# Altium project CHOCO_KEYBOARD.PrjPcb
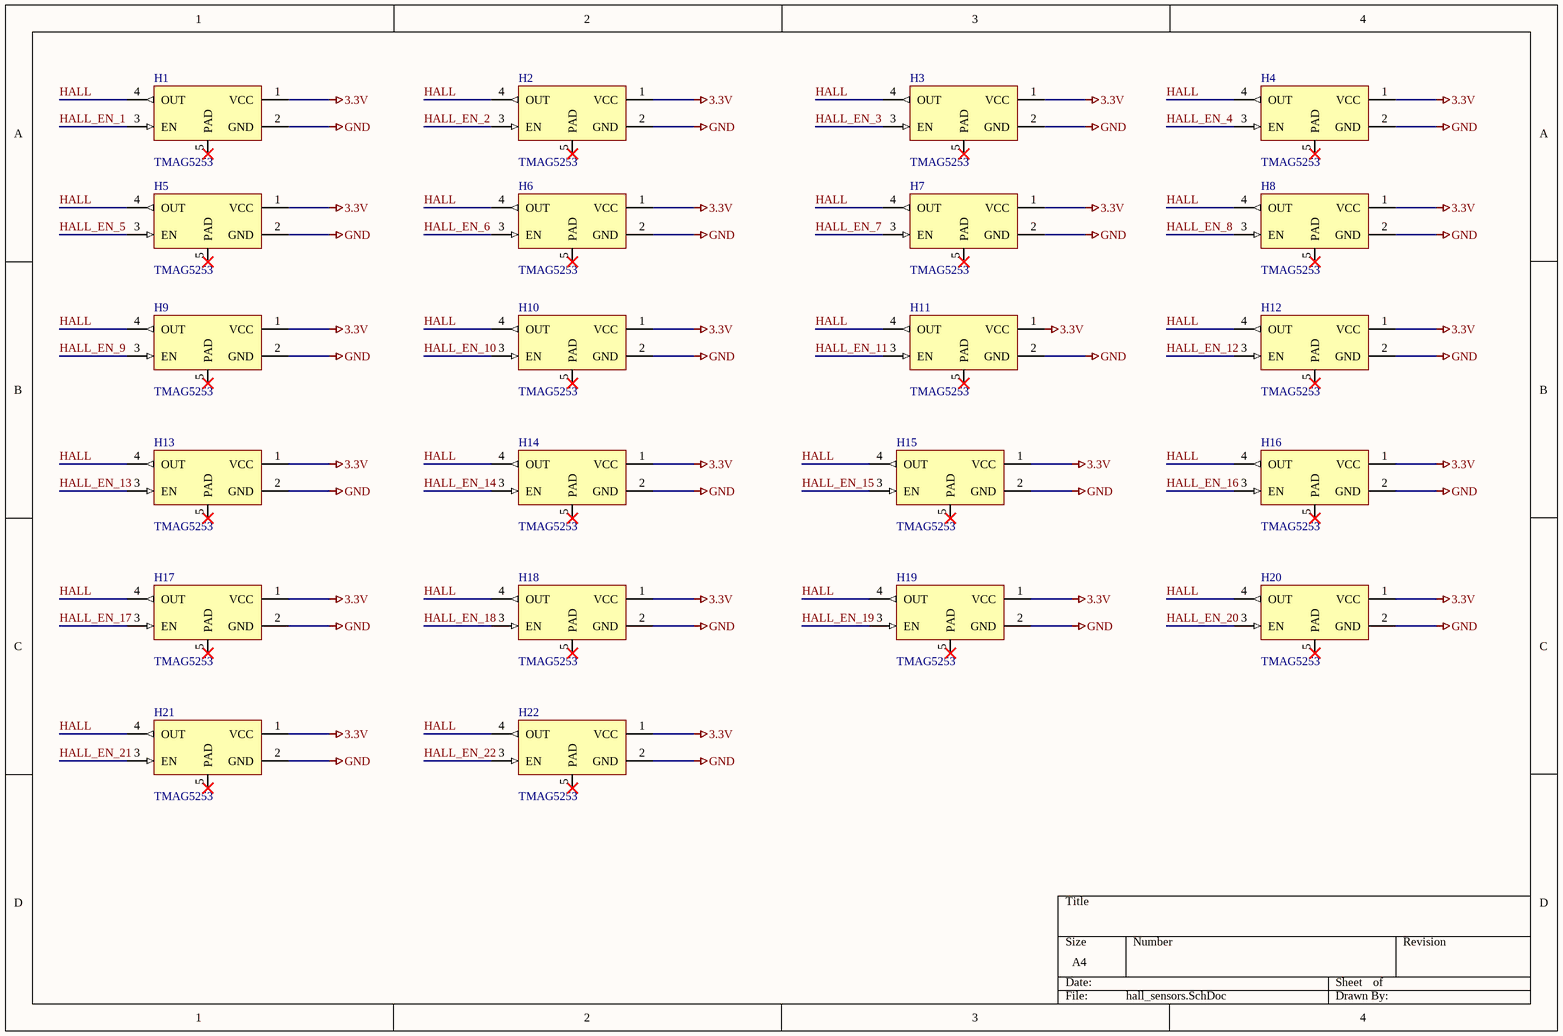
[diagram p0: hall_sensors.SchDoc]
4 sheets, 108 parts. Net scope: global (net labels, ports and power ports of the same name join across sheets).
Board files: choco_keyboard_left.PcbDoc, choco_keyboard_right.PcbDoc
Sheets:
  hall_sensors.SchDoc
  led.SchDoc
  mcu.SchDoc
  power_supply.SchDoc

## Sheet hall_sensors.SchDoc
size A4; SheetNumber: 1; SheetTotal: 4

### Parts
H1  TMAG5253  [IC_TMAG5253BA3IQDMRR]
H2  TMAG5253  [IC_TMAG5253BA3IQDMRR]
H3  TMAG5253  [IC_TMAG5253BA3IQDMRR]
H4  TMAG5253  [IC_TMAG5253BA3IQDMRR]
H5  TMAG5253  [IC_TMAG5253BA3IQDMRR]
H6  TMAG5253  [IC_TMAG5253BA3IQDMRR]
H7  TMAG5253  [IC_TMAG5253BA3IQDMRR]
H8  TMAG5253  [IC_TMAG5253BA3IQDMRR]
H9  TMAG5253  [IC_TMAG5253BA3IQDMRR]
H10  TMAG5253  [IC_TMAG5253BA3IQDMRR]
H11  TMAG5253  [IC_TMAG5253BA3IQDMRR]
H12  TMAG5253  [IC_TMAG5253BA3IQDMRR]
H13  TMAG5253  [IC_TMAG5253BA3IQDMRR]
H14  TMAG5253  [IC_TMAG5253BA3IQDMRR]
H15  TMAG5253  [IC_TMAG5253BA3IQDMRR]
H16  TMAG5253  [IC_TMAG5253BA3IQDMRR]
H17  TMAG5253  [IC_TMAG5253BA3IQDMRR]
H18  TMAG5253  [IC_TMAG5253BA3IQDMRR]
H19  TMAG5253  [IC_TMAG5253BA3IQDMRR]
H20  TMAG5253  [IC_TMAG5253BA3IQDMRR]
H21  TMAG5253  [IC_TMAG5253BA3IQDMRR]
H22  TMAG5253  [IC_TMAG5253BA3IQDMRR]

### Nets
3.3V: H1.1(VCC) H2.1(VCC) H3.1(VCC) H4.1(VCC) H5.1(VCC) H6.1(VCC) H7.1(VCC) H8.1(VCC) H9.1(VCC) H10.1(VCC) H11.1(VCC) H12.1(VCC) H13.1(VCC) H14.1(VCC) H15.1(VCC) H16.1(VCC) H17.1(VCC) H18.1(VCC) H19.1(VCC) H20.1(VCC) H21.1(VCC) H22.1(VCC)
GND: H1.2(GND) H2.2(GND) H3.2(GND) H4.2(GND) H5.2(GND) H6.2(GND) H7.2(GND) H8.2(GND) H9.2(GND) H10.2(GND) H11.2(GND) H12.2(GND) H13.2(GND) H14.2(GND) H15.2(GND) H16.2(GND) H17.2(GND) H18.2(GND) H19.2(GND) H20.2(GND) H21.2(GND) H22.2(GND)
HALL: H1.4(OUT) H2.4(OUT) H3.4(OUT) H4.4(OUT) H5.4(OUT) H6.4(OUT) H7.4(OUT) H8.4(OUT) H9.4(OUT) H10.4(OUT) H11.4(OUT) H12.4(OUT) H13.4(OUT) H14.4(OUT) H15.4(OUT) H16.4(OUT) H17.4(OUT) H18.4(OUT) H19.4(OUT) H20.4(OUT) H21.4(OUT) H22.4(OUT)
HALL_EN_1: H1.3(EN)
HALL_EN_2: H2.3(EN)
HALL_EN_3: H3.3(EN)
HALL_EN_4: H4.3(EN)
HALL_EN_5: H5.3(EN)
HALL_EN_6: H6.3(EN)
HALL_EN_7: H7.3(EN)
HALL_EN_8: H8.3(EN)
HALL_EN_9: H9.3(EN)
HALL_EN_10: H10.3(EN)
HALL_EN_11: H11.3(EN)
HALL_EN_12: H12.3(EN)
HALL_EN_13: H13.3(EN)
HALL_EN_14: H14.3(EN)
HALL_EN_15: H15.3(EN)
HALL_EN_16: H16.3(EN)
HALL_EN_17: H17.3(EN)
HALL_EN_18: H18.3(EN)
HALL_EN_19: H19.3(EN)
HALL_EN_20: H20.3(EN)
HALL_EN_21: H21.3(EN)
HALL_EN_22: H22.3(EN)

Not connected (* = marked no-connect by the designer): H1 5(PAD)*; H2 5(PAD)*; H3 5(PAD)*; H4 5(PAD)*; H5 5(PAD)*; H6 5(PAD)*; H7 5(PAD)*; H8 5(PAD)*; H9 5(PAD)*; H10 5(PAD)*; H11 5(PAD)*; H12 5(PAD)*; H13 5(PAD)*; H14 5(PAD)*; H15 5(PAD)*; H16 5(PAD)*; H17 5(PAD)*; H18 5(PAD)*; H19 5(PAD)*; H20 5(PAD)*; H21 5(PAD)*; H22 5(PAD)*

### Library data of the parts
H1-H22 = TMAG5253: Low-power linear Hall-effect sensor with enable pin in ultrasmall X2SON package; BOM_GROUP: HALL Switches; MF: Texas Instruments; MP: TMAG5253BA3IQDMRR; SnapEDA_Link: https://www.snapeda.com/parts/TMAG5253BA3IQDMRR/Texas+Instruments/view-part/?ref=snap; Package: XFDFN-4 Texas Instruments; Check_prices: https://www.snapeda.com/parts/TMAG5253BA3IQDMRR/Texas+Instruments/view-part/?ref=eda; Parameter 1: *

## Sheet led.SchDoc
size A4; SheetNumber: 2; SheetTotal: 4
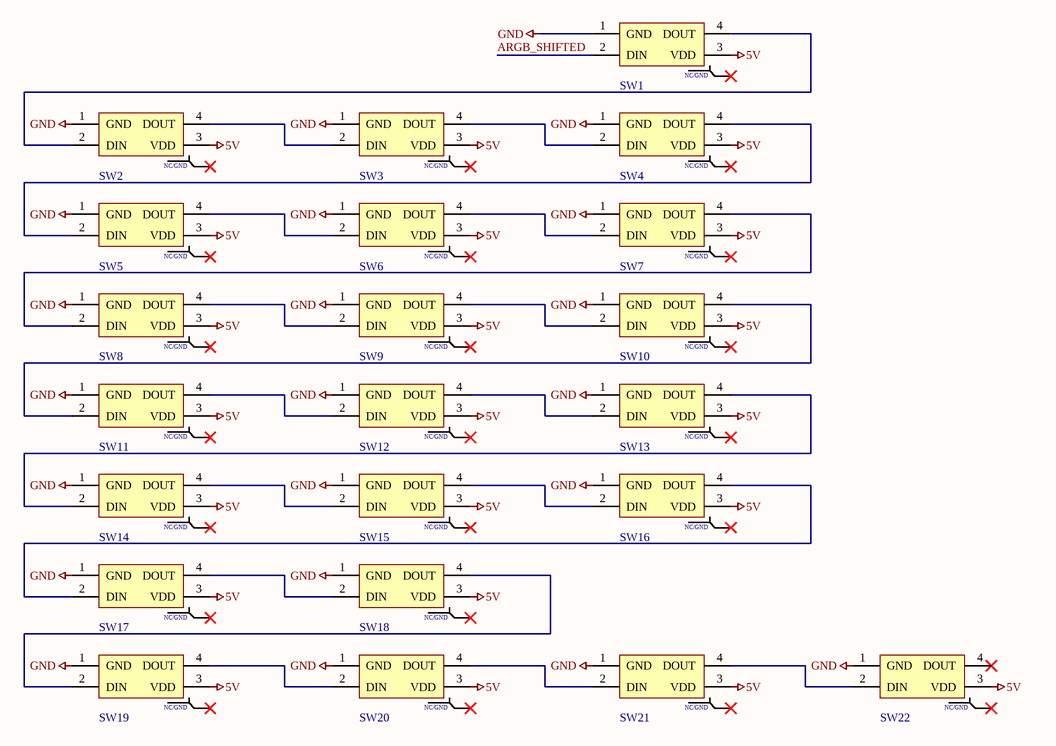
[diagram p1: led.SchDoc]

### Parts
SW1  Switch  [Switch]  (value not drawn)
SW2  Switch  [Switch]  (value not drawn)
SW3  Switch  [Switch]  (value not drawn)
SW4  Switch  [Switch]  (value not drawn)
SW5  Switch  [Switch]  (value not drawn)
SW6  Switch  [Switch]  (value not drawn)
SW7  Switch  [Switch]  (value not drawn)
SW8  Switch  [Switch]  (value not drawn)
SW9  Switch  [Switch]  (value not drawn)
SW10  Switch  [Switch]  (value not drawn)
SW11  Switch  [Switch]  (value not drawn)
SW12  Switch  [Switch]  (value not drawn)
SW13  Switch  [Switch]  (value not drawn)
SW14  Switch  [Switch]  (value not drawn)
SW15  Switch  [Switch]  (value not drawn)
SW16  Switch  [Switch]  (value not drawn)
SW17  Switch  [Switch]  (value not drawn)
SW18  Switch  [Switch]  (value not drawn)
SW19  Switch  [Switch]  (value not drawn)
SW20  Switch  [Switch]  (value not drawn)
SW21  Switch  [Switch]  (value not drawn)
SW22  Switch  [Switch]  (value not drawn)

### Nets
5V: SW1.3(VDD) SW2.3(VDD) SW3.3(VDD) SW4.3(VDD) SW5.3(VDD) SW6.3(VDD) SW7.3(VDD) SW8.3(VDD) SW9.3(VDD) SW10.3(VDD) SW11.3(VDD) SW12.3(VDD) SW13.3(VDD) SW14.3(VDD) SW15.3(VDD) SW16.3(VDD) SW17.3(VDD) SW18.3(VDD) SW19.3(VDD) SW20.3(VDD) SW21.3(VDD) SW22.3(VDD)
GND: SW1.1(GND) SW2.1(GND) SW3.1(GND) SW4.1(GND) SW5.1(GND) SW6.1(GND) SW7.1(GND) SW8.1(GND) SW9.1(GND) SW10.1(GND) SW11.1(GND) SW12.1(GND) SW13.1(GND) SW14.1(GND) SW15.1(GND) SW16.1(GND) SW17.1(GND) SW18.1(GND) SW19.1(GND) SW20.1(GND) SW21.1(GND) SW22.1(GND)
ARGB_SHIFTED: SW1.2(DIN)
NetSW1_4: SW1.4(DOUT) SW2.2(DIN)
NetSW2_4: SW2.4(DOUT) SW3.2(DIN)
NetSW3_4: SW3.4(DOUT) SW4.2(DIN)
NetSW4_4: SW4.4(DOUT) SW5.2(DIN)
NetSW5_4: SW5.4(DOUT) SW6.2(DIN)
NetSW6_4: SW6.4(DOUT) SW7.2(DIN)
NetSW7_4: SW7.4(DOUT) SW8.2(DIN)
NetSW8_4: SW8.4(DOUT) SW9.2(DIN)
NetSW9_4: SW9.4(DOUT) SW10.2(DIN)
NetSW10_4: SW10.4(DOUT) SW11.2(DIN)
NetSW11_4: SW11.4(DOUT) SW12.2(DIN)
NetSW12_4: SW12.4(DOUT) SW13.2(DIN)
NetSW13_4: SW13.4(DOUT) SW14.2(DIN)
NetSW14_4: SW14.4(DOUT) SW15.2(DIN)
NetSW15_4: SW15.4(DOUT) SW16.2(DIN)
NetSW16_4: SW16.4(DOUT) SW17.2(DIN)
NetSW17_4: SW17.4(DOUT) SW18.2(DIN)
NetSW18_4: SW18.4(DOUT) SW19.2(DIN)
NetSW19_4: SW19.4(DOUT) SW20.2(DIN)
NetSW20_4: SW20.4(DOUT) SW21.2(DIN)
NetSW21_4: SW21.4(DOUT) SW22.2(DIN)

Not connected (* = marked no-connect by the designer): SW1 5(NC/GND)*; SW2 5(NC/GND)*; SW3 5(NC/GND)*; SW4 5(NC/GND)*; SW5 5(NC/GND)*; SW6 5(NC/GND)*; SW7 5(NC/GND)*; SW8 5(NC/GND)*; SW9 5(NC/GND)*; SW10 5(NC/GND)*; SW11 5(NC/GND)*; SW12 5(NC/GND)*; SW13 5(NC/GND)*; SW14 5(NC/GND)*; SW15 5(NC/GND)*; SW16 5(NC/GND)*; SW17 5(NC/GND)*; SW18 5(NC/GND)*; SW19 5(NC/GND)*; SW20 5(NC/GND)*; SW21 5(NC/GND)*; SW22 4(DOUT)* 5(NC/GND)*

### Library data of the parts
SW1-SW22 = Switch: Gateron Magnetic Jade Switch; BOM_GROUP: ARGB

## Sheet mcu.SchDoc
size A4; SheetNumber: 3; SheetTotal: 4
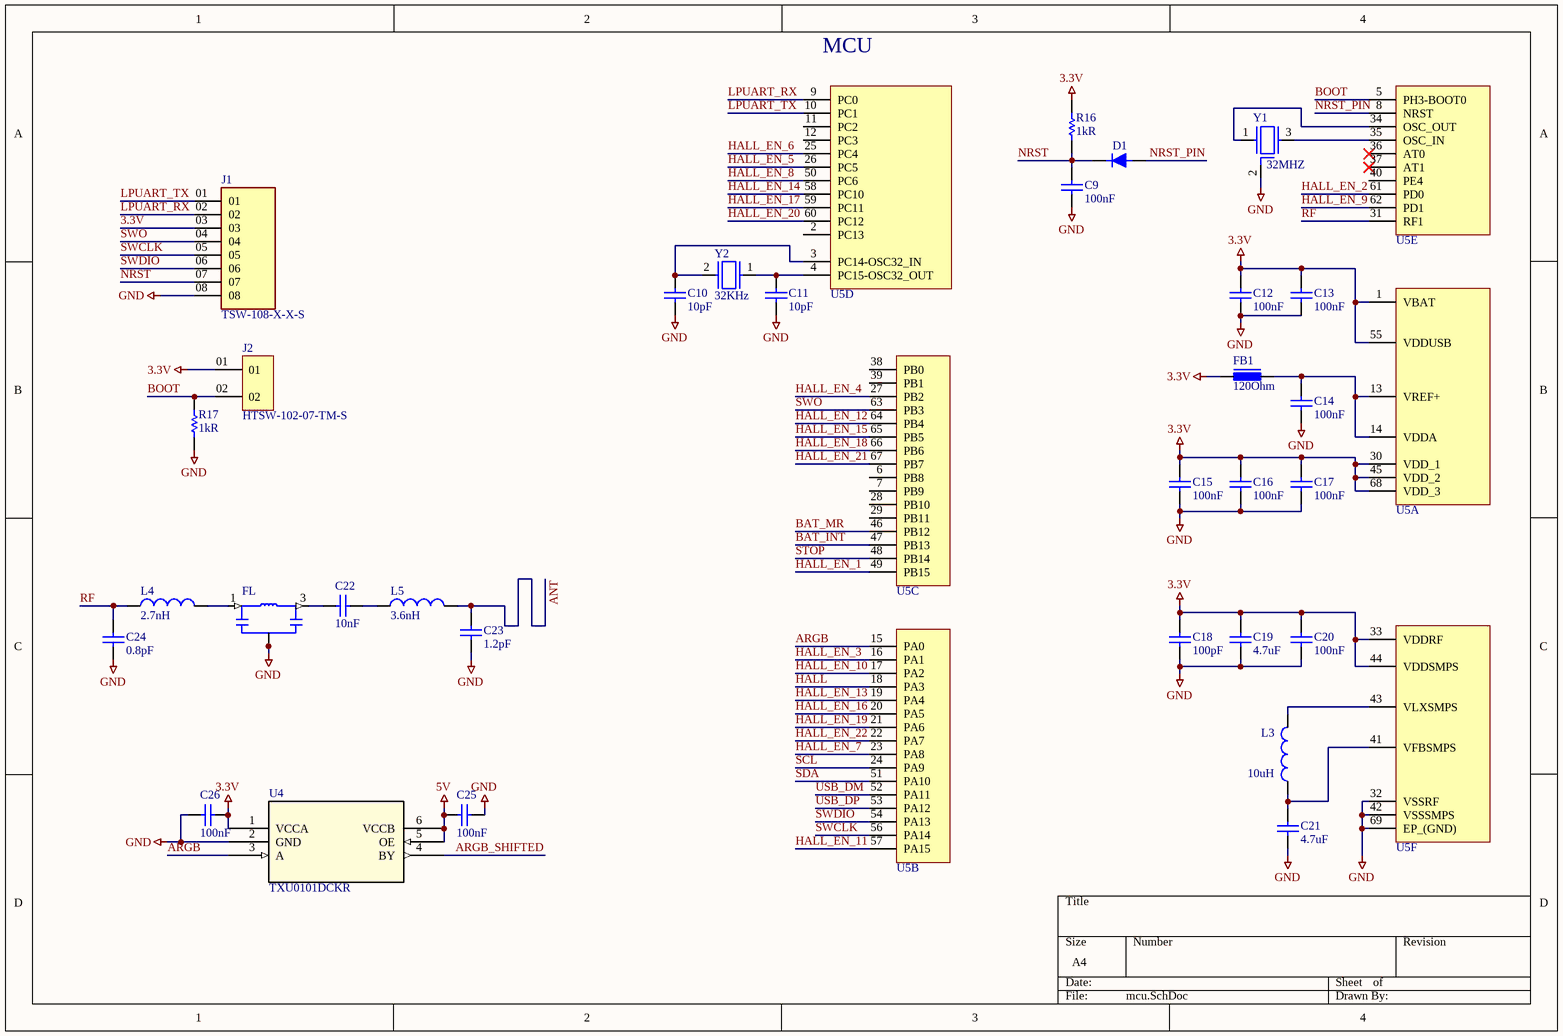
[diagram p2: mcu.SchDoc]

### Parts
C9  100nF  [CAP_0402]
C10  10pF  [CAP_0402]
C11  10pF  [CAP_0402]
C12  100nF  [CAP_0402]
C13  100nF  [CAP_0402]
C14  100nF  [CAP_0402]
C15  100nF  [CAP_0402]
C16  100nF  [CAP_0402]
C17  100nF  [CAP_0402]
C18  100pF  [CAP_0402]
C19  4.7uF  [CAP_0402]
C20  100nF  [CAP_0402]
C21  4.7uF  [CAP_0402]
C22  10nF  [CAP_0402]
C23  1.2pF  [CAP_0402]
C24  0.8pF  [CAP_0402]
C25  100nF  [CAP_0402]
C26  100nF  [CAP_0402]
D1  0.3A  [SODFL1608X70N]  (value not drawn)
FB1  120Ohm  [BEADC1005X50N]
FL  LFB182G45CGFD436  [FIL_LFB182G45CGFD436]  (value not drawn)
J1  TSW-108-X-X-S  [SAMTEC_TSW-108-X-X-S]
J2  HTSW-102-07-TM-S  [SAMTEC_HTSW-102-07-TM-S]
L3  10uH  [INDC1106X70N]
L4  2.7nH  [INDC1005X55N]
L5  3.6nH  [INDC1005X55N]
R16  1kR  [RES_0402]
R17  1kR  [RES_0402]
U4  TXU0101DCKR  [TXU0101DCKR]
U5  STM32WB55RGV6  [QFN40P800X800X100-69L-D]  (value not drawn)  (parts A,B,C,D,E,F of 6)
Y1  32MHZ  [NX2016SA32MEXS00ACS06465]
Y2  32KHz  [NX2012SA32768KSTDMUB1]

### Nets
3.3V: C12.2 C13.2 C15.2 C16.2 C17.2 C18.2 C19.2 C20.2 C26.1 FB1.1 J1.03 J2.01 R16.2 U4.1(VCCA) U5.1(VBAT) U5.30(VDD_1) U5.33(VDDRF) U5.44(VDDSMPS) U5.45(VDD_2) U5.55(VDDUSB) U5.68(VDD_3)
5V: C25.2 U4.5(OE) U4.6(VCCB)
GND: C9.2 C10.1 C11.1 C12.1 C13.1 C14.1 C15.1 C16.1 C17.1 C18.1 C19.1 C20.1 C21.1 C23.2 C24.1 C25.1 C26.2 FL.2(GND) FL.2_1(GND) J1.08 R17.1 U4.2(GND) U5.32(VSSRF) U5.42(VSSSMPS) U5.69(EP_(GND)) Y1.2(GND)
ANT: C23.1 L5.2
ARGB: U4.3(A) U5.15(PA0)
ARGB_SHIFTED: U4.4(BY)
BAT_INT: U5.47(PB13)
BAT_MR: U5.46(PB12)
BOOT: J2.02 R17.2 U5.5(PH3-BOOT0)
HALL: U5.18(PA3)
HALL_EN_1: U5.49(PB15)
HALL_EN_2: U5.61(PD0)
HALL_EN_3: U5.16(PA1)
HALL_EN_4: U5.27(PB2)
HALL_EN_5: U5.26(PC5)
HALL_EN_6: U5.25(PC4)
HALL_EN_7: U5.23(PA8)
HALL_EN_8: U5.50(PC6)
HALL_EN_9: U5.62(PD1)
HALL_EN_10: U5.17(PA2)
HALL_EN_11: U5.57(PA15)
HALL_EN_12: U5.64(PB4)
HALL_EN_13: U5.19(PA4)
HALL_EN_14: U5.58(PC10)
HALL_EN_15: U5.65(PB5)
HALL_EN_16: U5.20(PA5)
HALL_EN_17: U5.59(PC11)
HALL_EN_18: U5.66(PB6)
HALL_EN_19: U5.21(PA6)
HALL_EN_20: U5.60(PC12)
HALL_EN_21: U5.67(PB7)
HALL_EN_22: U5.22(PA7)
LPUART_RX: J1.02 U5.9(PC0)
LPUART_TX: J1.01 U5.10(PC1)
NRST: C9.1 D1.1(K) J1.07 R16.1
NRST_PIN: D1.2(A) U5.8(NRST)
RF: C24.2 L4.1 U5.31(RF1)
SCL: U5.24(PA9)
SDA: U5.51(PA10)
STOP: U5.48(PB14)
SWCLK: J1.05 U5.56(PA14)
SWDIO: J1.06 U5.54(PA13)
SWO: J1.04 U5.63(PB3)
USB_DM: U5.52(PA11)
USB_DP: U5.53(PA12)
NetC10_2: C10.2 U5.3(PC14-OSC32_IN) Y2.2(CRYSTAL_2)
NetC11_2: C11.2 U5.4(PC15-OSC32_OUT) Y2.1(CRYSTAL_1)
NetC14_2: C14.2 FB1.2 U5.13(VREF+) U5.14(VDDA)
NetC21_2: C21.2 L3.1 U5.41(VFBSMPS)
NetC22_1: C22.1 FL.3(OUT)
NetC22_2: C22.2 L5.1
NetFL_1: FL.1(IN) L4.2
NetL3_2: L3.2 U5.43(VLXSMPS)
NetU5_34: U5.34(OSC_OUT) Y1.1(CRYSTAL_1)
NetU5_35: U5.35(OSC_IN) Y1.3(CRYSTAL_2)

Not connected (* = marked no-connect by the designer): U5 2(PC13) 6(PB8) 7(PB9) 11(PC2) 12(PC3) 28(PB10) 29(PB11) 36(AT0)* 37(AT1)* 38(PB0) 39(PB1) 40(PE4)

### Notes on the sheet
- (near U5) MCU

### Library data of the parts
C9 C12-C17 C20 C25 C26 = Cap_100nF_0402: MF: Murata; MP: GRM022R60J222KE19L; BOM_GROUP: MCU & Payload; SnapEDA_Link: https://www.snapeda.com/parts/GRM022R60J222KE19L/Murata/view-part/?ref=snap; Package: 0402 Murata; Value: *; Check_prices: https://www.snapeda.com/parts/GRM022R60J222KE19L/Murata/view-part/?ref=eda
C10 C11 = Cap_10pF_0402: MF: Murata; MP: GRM022R60J222KE19L; BOM_GROUP: MCU & Payload; SnapEDA_Link: https://www.snapeda.com/parts/GRM022R60J222KE19L/Murata/view-part/?ref=snap; Package: 0402 Murata; Value: *; Check_prices: https://www.snapeda.com/parts/GRM022R60J222KE19L/Murata/view-part/?ref=eda
C18 = Cap_100pF_0402: MF: Murata; MP: GRM022R60J222KE19L; BOM_GROUP: MCU & Payload; SnapEDA_Link: https://www.snapeda.com/parts/GRM022R60J222KE19L/Murata/view-part/?ref=snap; Package: 0402 Murata; Value: *; Check_prices: https://www.snapeda.com/parts/GRM022R60J222KE19L/Murata/view-part/?ref=eda
C19 C21 = Cap_4.7uF_0402: MF: Murata; MP: GRM022R60J222KE19L; BOM_GROUP: MCU & Payload; SnapEDA_Link: https://www.snapeda.com/parts/GRM022R60J222KE19L/Murata/view-part/?ref=snap; Package: 0402 Murata; Value: *; Check_prices: https://www.snapeda.com/parts/GRM022R60J222KE19L/Murata/view-part/?ref=eda
C22 = Cap_10nF_0402: BOM_GROUP: Antena; MF: Murata; MP: GRM022R60J222KE19L; SnapEDA_Link: https://www.snapeda.com/parts/GRM022R60J222KE19L/Murata/view-part/?ref=snap; Package: 0402 Murata; Check_prices: https://www.snapeda.com/parts/GRM022R60J222KE19L/Murata/view-part/?ref=eda; Parameter 1: *
C23 = Cap_1.2pF_0402: BOM_GROUP: Antena; MF: Murata; MP: GRM022R60J222KE19L; SnapEDA_Link: https://www.snapeda.com/parts/GRM022R60J222KE19L/Murata/view-part/?ref=snap; Package: 0402 Murata; Check_prices: https://www.snapeda.com/parts/GRM022R60J222KE19L/Murata/view-part/?ref=eda; Parameter 1: *
C24 = Cap_0.8pF_0402: BOM_GROUP: Antena; MF: Murata; MP: GRM022R60J222KE19L; SnapEDA_Link: https://www.snapeda.com/parts/GRM022R60J222KE19L/Murata/view-part/?ref=snap; Package: 0402 Murata; Check_prices: https://www.snapeda.com/parts/GRM022R60J222KE19L/Murata/view-part/?ref=eda; Parameter 1: *
D1 = BAT54KFILM: BAT54KFILM, Schottky Diode,  0.3A max, 40V 5ns, 2-Pin, SOD-523; Manufacturer_Name: STMicroelectronics; Geometry.Height: 0.7mm; BOM_GROUP: MCU & Payload; Mouser Part Number: 511-BAT54KFILM; Mouser Price/Stock: https://www.mouser.co.uk/ProductDetail/STMicroelectronics/BAT54KFILM?qs=jZi1jxfVU95Y9ce6l3OT%252BA%3D%3D; Manufacturer_Part_Number: BAT54KFILM; Datasheet Link: http://www.st.com/web/en/resource/technical/document/datasheet/CD00001322.pdf
FB1 = MMZ1005S121CTD25: Ferrite Bead; MF: Tai Tech; MP: FCM1608KF-601T05; BOM_GROUP: MCU & Payload; SnapEDA_Link: https://www.snapeda.com/parts/FCM1608KF-601T05/Tai+Tech/view-part/?ref=snap; Package: None; Value: *; Check_prices: https://www.snapeda.com/parts/FCM1608KF-601T05/Tai+Tech/view-part/?ref=eda
FL = LFB182G45CGFD436: RF Filter Band Pass 2450MHz 2400MHz to 2500MHz 2.8dB 50Ohm SMD 6Pin 0603; BOM_GROUP: Antena; MF: Murata; Availability: Unavailable; Price: None; Package: 0603 Murata Electronics; MP: LFB182G45CGFD436; SnapEDA_Link: https://www.snapeda.com/parts/LFB182G45CGFD436/Murata/view-part/2721840/?ref=snap; Parameter 1: *
J1 = TSW-108-X-X-S: Connector Header Through Hole 8 position 0.100 (2.54mm); MF: Samtec; MP: TSW-108-23-L-S; BOM_GROUP: MCU & Payload; SnapEDA_Link: https://www.snapeda.com/parts/TSW-108-23-L-S/Samtec/view-part/?ref=snap; Package: None; Value: *; Check_prices: https://www.snapeda.com/parts/TSW-108-23-L-S/Samtec/view-part/?ref=eda
J2 = HTSW-102-07-TM-S: HEADER, 2 CONTACTS, 1 ROW, THROUGH HOLE, 2.54 MM; Connector Systems:Board-to-Board; Pitch Spacing:2.54mm; No. of Rows:1Rows; No. of Contacts:2Contacts; Contact Termination Type:Through Hole; Product Range:HTSW Series; Gender:Header RoHS Compliant: Yes; MP: HTSW10207TMS; MF: Samtec; BOM_GROUP: MCU & Payload; SnapEDA_Link: https://www.snapeda.com/parts/HTSW10207TMS/Samtec/view-part/?ref=snap; Value: *; Purchase-URL: https://pricing.snapeda.com/search/part/HTSW10207TMS/?ref=eda; Availability: In Stock; Check_prices: https://www.snapeda.com/parts/HTSW10207TMS/Samtec/view-part/?ref=eda; Package: None; Price: None
L3 = LQW15DN100M00D: Inductor with Inductance: 10uH Tol. +/-20%, Package: 0402 (1005); MF: Murata Electronics North America; BOM_GROUP: MCU & Payload; Package: 1106 Murata; MP: LQW15DN100M00D; Purchase-URL: https://pricing.snapeda.com/search/part/LQW15DN100M00D/?ref=eda; Value: *; SnapEDA_Link: https://www.snapeda.com/parts/LQW15DN100M00D/Murata%20Electronics%20North%20America/view-part/3223358/?ref=snap; Availability: Good; Price: None; Check_prices: https://www.snapeda.com/parts/LQW15DN100M00D/Murata%20Electronics%20North%20America/view-part/3223358/?ref=eda
L4 L5 = LQG15HS3N6S02D: Inductor with Inductance: 3.6nH Tol. +/-0.3nH, Package: 0402 _1005_; MF: Murata; BOM_GROUP: Antena; Package: 1005 Murata; MP: LQG15HS3N6S02D; Price: None; Availability: Unavailable; SnapEDA_Link: https://www.snapeda.com/parts/LQG15HS3N6S02D/Murata%20Electronics%20North%20America/view-part/1501786/?ref=snap; Parameter 1: *
R16 R17 = Res_1kR_0402: BOM_GROUP: MCU & Payload; Package: 0402; Resistans: 1kR
U5 = STM32WB55RGV6: BOM_GROUP: MCU & Payload
Y1 = NX2016SA-32MHZ: Crystal or Oscillator; Manufacturer_Name: NDK; Manufacturer_Part_Number: NX2016SA-26MHZ-EXS00A-CS06025; BOM_GROUP: MCU & Payload; Datasheet Link: https://datasheet.datasheetarchive.com/originals/distributors/Datasheets_SAMA/8da4d094c01ffba0c34ffc4b8a2d69e9.pdf; Mouser Part Number: 344-NX2016SA26S06025; Mouser Price/Stock: https://www.mouser.co.uk/ProductDetail/NDK/NX2016SA-26MHZ-EXS00A-CS06025?qs=w%2Fv1CP2dgqrdkfe8%2Fku9TQ%3D%3D
Y2 = NX2012SA-32.768K: Crystal or Oscillator; Manufacturer_Name: NDK; Manufacturer_Part_Number: NX2012SA-32.768K-STD-MUB-1; BOM_GROUP: MCU & Payload; Datasheet Link: https://www.mouser.de/datasheet/2/905/c_NX2012SA-STD-MUB-1_e-1317508.pdf; Height: 0.6mm; Mouser Part Number: 344-NX2012SA32768K1; Mouser Price/Stock: https://www.mouser.co.uk/ProductDetail/NDK/NX2012SA-32.768K-STD-MUB-1?qs=55YtniHzbhA%252B6%2Fl1MwFZaQ%3D%3D

## Sheet power_supply.SchDoc
size A4; SheetNumber: 4; SheetTotal: 4
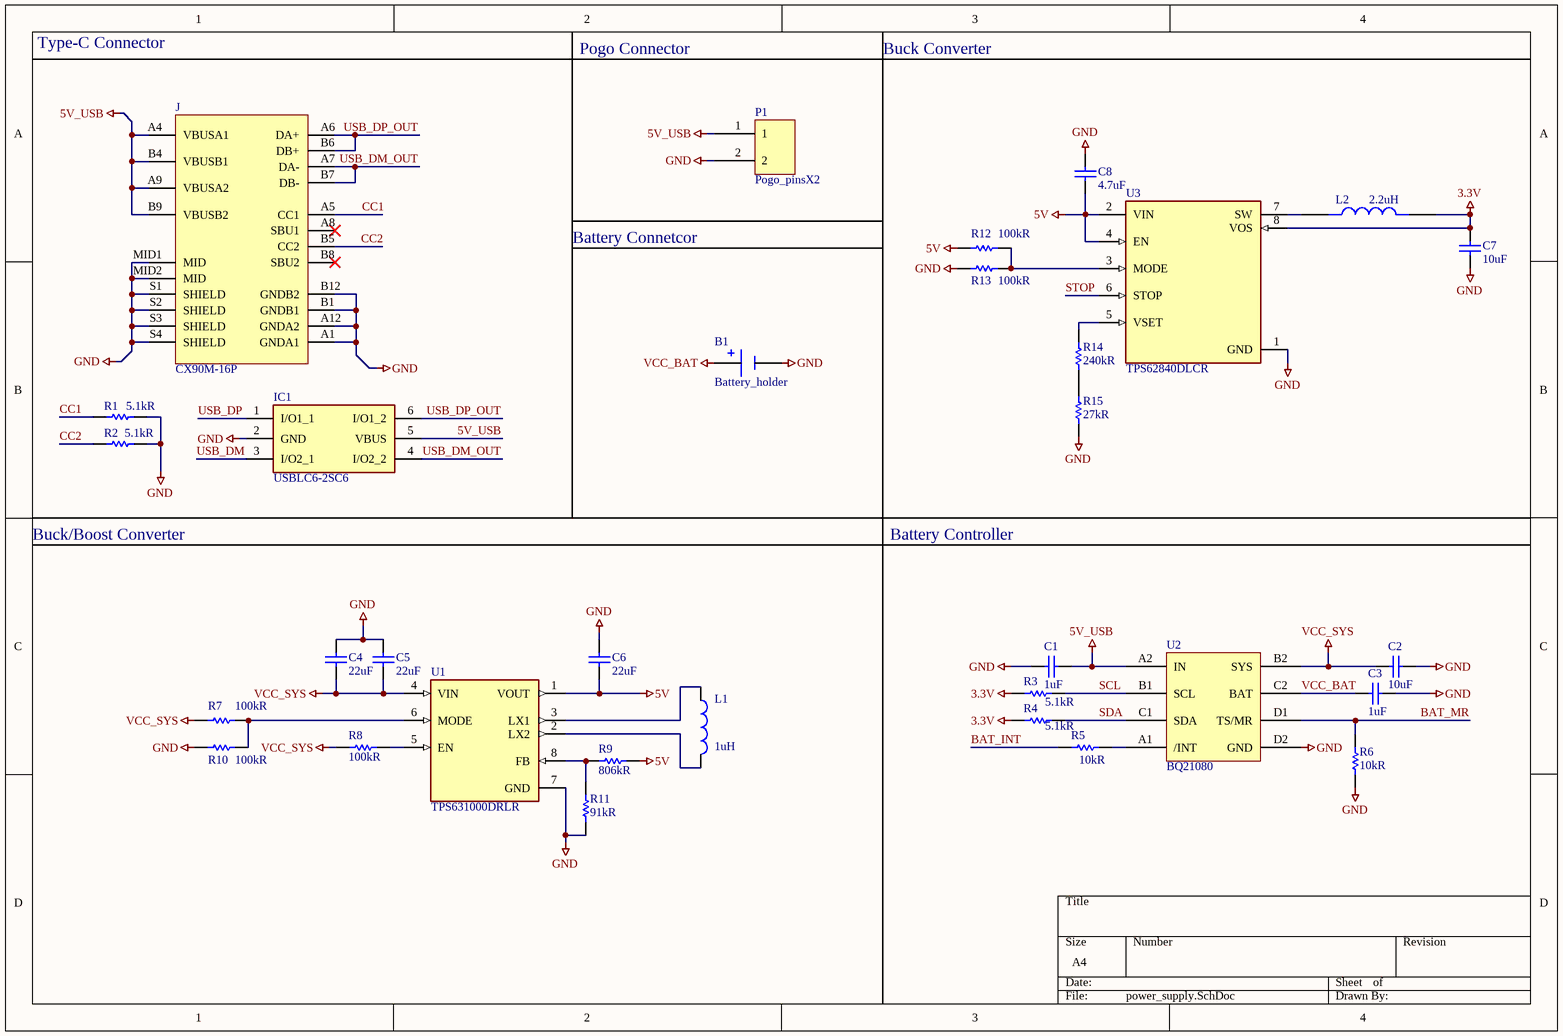
[diagram p3: power_supply.SchDoc]

### Parts
B1  Battery_holder  [battery connection]
C1  1uF  [CAP_0402]
C2  10uF  [CAP_0402]
C3  1uF  [CAP_0402]
C4  22uF  [CAP_0402]
C5  22uF  [CAP_0402]
C6  22uF  [CAP_0402]
C7  10uF  [CAP_0402]
C8  4.7uF  [CAP_0402]
IC1  USBLC6-2SC6  [SOT95P280X145-6N]
J  CX90M-16P  [HRS_CX90M-16P]
L1  1uH  [INDC1608X100N]
L2  2.2uH  [INDC2012X100N]
P1  Pogo_pinsX2  [pogo_2_pins_amgled]
R1  5.1kR  [RES_0402]
R2  5.1kR  [RES_0402]
R3  5.1kR  [RES_0402]
R4  5.1kR  [RES_0402]
R5  10kR  [RES_0402]
R6  10kR  [RES_0402]
R7  100kR  [RES_0402]
R8  100kR  [RES_0402]
R9  806kR  [RES_0402]
R10  100kR  [RES_0402]
R11  91kR  [RES_0402]
R12  100kR  [RES_0402]
R13  100kR  [RES_0402]
R14  240kR  [RES_0402]
R15  27kR  [RES_0402]
U1  TPS631000DRLR  [SOT50P160X60-8N]
U2  BQ21080  [IC_BQ25180YBGR]
U3  TPS62840DLCR  [SON50P200X150X100-8N]

### Nets
3.3V: C7.2 L2.2 R3.2 R4.2 U3.8(VOS)
5V: C6.1 C8.2 R9.1 R12.1 U1.1(VOUT) U3.2(VIN) U3.4(EN)
5V_USB: C1.2 IC1.5(VBUS) J.A4(VBUSA1) J.A9(VBUSA2) J.B4(VBUSB1) J.B9(VBUSB2) P1.1 U2.A2(IN)
GND: B1.2(NEG) C1.1 C2.1 C3.1 C4.2 C5.2 C6.2 C7.1 C8.1 IC1.2(GND) J.A1(GNDA1) J.A12(GNDA2) J.B1(GNDB1) J.B12(GNDB2) J.MID1(MID) J.MID2(MID) J.S1(SHIELD) J.S2(SHIELD) J.S3(SHIELD) J.S4(SHIELD) P1.2 R1.2 R2.2 R6.2 R10.1 R11.1 R13.1 R15.1 U1.7(GND) U2.D2(GND) U3.1(GND)
VCC_BAT: B1.1(POS) C3.2 U2.C2(BAT)
VCC_SYS: C2.2 C4.1 C5.1 R7.1 R8.1 U1.4(VIN) U2.B2(SYS)
BAT_INT: R5.2
BAT_MR: R6.1 U2.D1(TS/MR)
CC1: J.A5(CC1) R1.1
CC2: J.B5(CC2) R2.1
SCL: R3.1 U2.B1(SCL)
SDA: R4.1 U2.C1(SDA)
STOP: U3.6(STOP)
USB_DM: IC1.3(I/O2_1)
USB_DM_OUT: IC1.4(I/O2_2) J.A7(DA-) J.B7(DB-)
USB_DP: IC1.1(I/O1_1)
USB_DP_OUT: IC1.6(I/O1_2) J.A6(DA+) J.B6(DB+)
NetL1_1: L1.1 U1.3(LX1)
NetL1_2: L1.2 U1.2(LX2)
NetL2_1: L2.1 U3.7(SW)
NetR5_1: R5.1 U2.A1(/INT)
NetR7_2: R7.2 R10.2 U1.6(MODE)
NetR8_2: R8.2 U1.5(EN)
NetR9_2: R9.2 R11.2 U1.8(FB)
NetR12_2: R12.2 R13.2 U3.3(MODE)
NetR14_1: R14.1 U3.5(VSET)
NetR14_2: R14.2 R15.2

Not connected (* = marked no-connect by the designer): J A8(SBU1)* B8(SBU2)*

### Notes on the sheet
- Type-C Connector
- Pogo Connector
- Buck Converter
- Battery Connetcor
- Buck/Boost Converter
- Battery Controller

### Library data of the parts
B1 = Battery_holder: li-ion 14500 battery holder; BOM_GROUP: Power Connectors
C1 C3 = Cap_1uF_0402: MF: Murata; MP: GRM022R60J222KE19L; BOM_GROUP: Battery managment; SnapEDA_Link: https://www.snapeda.com/parts/GRM022R60J222KE19L/Murata/view-part/?ref=snap; Package: 0402 Murata; Value: *; Check_prices: https://www.snapeda.com/parts/GRM022R60J222KE19L/Murata/view-part/?ref=eda
C2 = Cap_10uF_0402: MF: Murata; MP: GRM022R60J222KE19L; BOM_GROUP: Battery managment; SnapEDA_Link: https://www.snapeda.com/parts/GRM022R60J222KE19L/Murata/view-part/?ref=snap; Package: 0402 Murata; Value: *; Check_prices: https://www.snapeda.com/parts/GRM022R60J222KE19L/Murata/view-part/?ref=eda
C4-C6 = Cap_22uF_0402: MF: Murata; MP: GRM022R60J222KE19L; BOM_Group: Buck/Boost Converter to 5V; SnapEDA_Link: https://www.snapeda.com/parts/GRM022R60J222KE19L/Murata/view-part/?ref=snap; Package: 0402 Murata; Value: *; Check_prices: https://www.snapeda.com/parts/GRM022R60J222KE19L/Murata/view-part/?ref=eda
C7 = Cap_10uF_0402: MF: Murata; MP: GRM022R60J222KE19L; BOM_Group: Buck 3.3V Converter; SnapEDA_Link: https://www.snapeda.com/parts/GRM022R60J222KE19L/Murata/view-part/?ref=snap; Package: 0402 Murata; Value: *
C8 = Cap_4.7uF_0402: MF: Murata; MP: GRM022R60J222KE19L; BOM_Group: Buck 3.3V Converter; SnapEDA_Link: https://www.snapeda.com/parts/GRM022R60J222KE19L/Murata/view-part/?ref=snap; Package: 0402 Murata; Value: *
IC1 = USBLC6-2SC6: Integrated Circuit; Manufacturer_Name: STMicroelectronics; BOM_GROUP: Type-c; Datasheet Link: http://www.st.com/st-web-ui/static/active/en/resource/technical/document/datasheet/CD00050750.pdf; Height: 1.45mm; Manufacturer_Part_Number: USBLC6-2SC6; Mouser Part Number: 511-USBLC6-2SC6; Mouser Price/Stock: https://www.mouser.co.uk/ProductDetail/STMicroelectronics/USBLC6-2SC6?qs=po45yt2pPpu%2FhNIlwQdTlg%3D%3D; Arrow Part Number: USBLC6-2SC6; Arrow Price/Stock: https://www.arrow.com/en/products/usblc6-2sc6/stmicroelectronics?utm_currency=USD&region=europe
J = CX90M-16P: USB-C _USB TYPE-C_ USB 3.1 _USB 3.1 Gen 2, Superspeed+_ Receptacle Connector 24 _16+8 Dummy_ Position Board Edge, Cutout; Surface Mount; Through Hole, Right Angle; MF: Hirose Electric Co Ltd; BOM_GROUP: Type-c; MP: CX90M-16P; Price: None; Package: None; Availability: Unavailable; SnapEDA_Link: https://www.snapeda.com/parts/CX90M-16P/Hirose%20Electric%20Co%20Ltd/view-part/3218310/?ref=snap; Value: *
L1 = DFE18SAN1R0MG0L: BOM_Group: Buck/Boost Converter to 5V; Package: None; Price: None; Value: *; MP: DFE18SAN1R0MG0L; Availability: Unavailable
L2 = MLP2012S2R2MT0S1: 2.2 ÂµH Shielded Multilayer Inductor 800 mA 299mOhm Max 0805 (2012 Metric); MF: TDK; BOM_Group: Buck 3.3V Converter; SnapEDA_Link: https://www.snapeda.com/parts/MLP2012S2R2MT0S1/TDK/view-part/?ref=snap; Package: 2012 TDK; Value: *; MP: MLP2012S2R2MT0S1
P1 = Pogo_pinsX2: BOM_GROUP: Power Connectors
R1 R2 = Res_5.1kR_0402: Resistans: 1kR; BOM_GROUP: Type-c; Package: 0402
R3 R4 = Res_5.1kR_0402: Resistans: 1kR; BOM_GROUP: Battery managment; Package: 0402
R5 R6 = Res_10kR_0402: Resistans: 1kR; BOM_GROUP: Battery managment; Package: 0402
R7 R8 R10 = Res_100kR_0402_1: Resistans: 1kR; BOM_Group: Buck/Boost Converter to 5V; Package: 0402
R9 = Res_806kR_0402_1: Resistans: 1kR; BOM_Group: Buck/Boost Converter to 5V; Package: 0402
R11 = Res_91kR_0402: Resistans: 1kR; BOM_Group: Buck/Boost Converter to 5V; Package: 0402
R12 R13 = Res_100kR_0402_1: Resistans: 1kR; BOM_Group: Buck 3.3V Converter; Package: 0402
R14 = Res_240kR_0402: Resistans: 1kR; BOM_Group: Buck 3.3V Converter; Package: 0402
R15 = Res_27kR_0402: Resistans: 1kR; BOM_Group: Buck 3.3V Converter; Package: 0402
U1 = TPS631000DRLR: 1.5-A output current, high-power-density buck-boost converter; MF: Texas Instruments; BOM_Group: Buck/Boost Converter to 5V; SnapEDA_Link: https://www.snapeda.com/parts/TPS631000DRLR/Texas+Instruments/view-part/?ref=snap; Package: SOT-583 Texas Instruments; Value: *; MP: TPS631000DRLR; Check_prices: https://www.snapeda.com/parts/TPS631000DRLR/Texas+Instruments/view-part/?ref=eda
U2 = BQ21080: Battery Managment IC; BOM_GROUP: Battery managment
U3 = TPS62840DLCR: None <a href="https://snapeda.com/parts/TPS62840DLCR/Texas%20Instruments/view-part/?ref=eda">Check prices</a>; BOM_Group: Buck 3.3V Converter; Price: None; MP: TPS62840DLCR; Availability: Unavailable; Package: None; Value: *

## Nets that join several sheets
3.3V: hall_sensors (22 pins), mcu (21 pins), power_supply (5 pins)
5V: led (22 pins), mcu (C25.2 U4.5 U4.6), power_supply (7 pins)
GND: hall_sensors (22 pins), led (22 pins), mcu (26 pins), power_supply (31 pins)
ARGB_SHIFTED: led (SW1.2), mcu (U4.4)
BAT_INT: mcu (U5.47), power_supply (R5.2)
BAT_MR: mcu (U5.46), power_supply (R6.1 U2.D1)
HALL: hall_sensors (22 pins), mcu (U5.18)
HALL_EN_1: hall_sensors (H1.3), mcu (U5.49)
HALL_EN_2: hall_sensors (H2.3), mcu (U5.61)
HALL_EN_3: hall_sensors (H3.3), mcu (U5.16)
HALL_EN_4: hall_sensors (H4.3), mcu (U5.27)
HALL_EN_5: hall_sensors (H5.3), mcu (U5.26)
HALL_EN_6: hall_sensors (H6.3), mcu (U5.25)
HALL_EN_7: hall_sensors (H7.3), mcu (U5.23)
HALL_EN_8: hall_sensors (H8.3), mcu (U5.50)
HALL_EN_9: hall_sensors (H9.3), mcu (U5.62)
HALL_EN_10: hall_sensors (H10.3), mcu (U5.17)
HALL_EN_11: hall_sensors (H11.3), mcu (U5.57)
HALL_EN_12: hall_sensors (H12.3), mcu (U5.64)
HALL_EN_13: hall_sensors (H13.3), mcu (U5.19)
HALL_EN_14: hall_sensors (H14.3), mcu (U5.58)
HALL_EN_15: hall_sensors (H15.3), mcu (U5.65)
HALL_EN_16: hall_sensors (H16.3), mcu (U5.20)
HALL_EN_17: hall_sensors (H17.3), mcu (U5.59)
HALL_EN_18: hall_sensors (H18.3), mcu (U5.66)
HALL_EN_19: hall_sensors (H19.3), mcu (U5.21)
HALL_EN_20: hall_sensors (H20.3), mcu (U5.60)
HALL_EN_21: hall_sensors (H21.3), mcu (U5.67)
HALL_EN_22: hall_sensors (H22.3), mcu (U5.22)
SCL: mcu (U5.24), power_supply (R3.1 U2.B1)
SDA: mcu (U5.51), power_supply (R4.1 U2.C1)
STOP: mcu (U5.48), power_supply (U3.6)
USB_DM: mcu (U5.52), power_supply (IC1.3)
USB_DP: mcu (U5.53), power_supply (IC1.1)